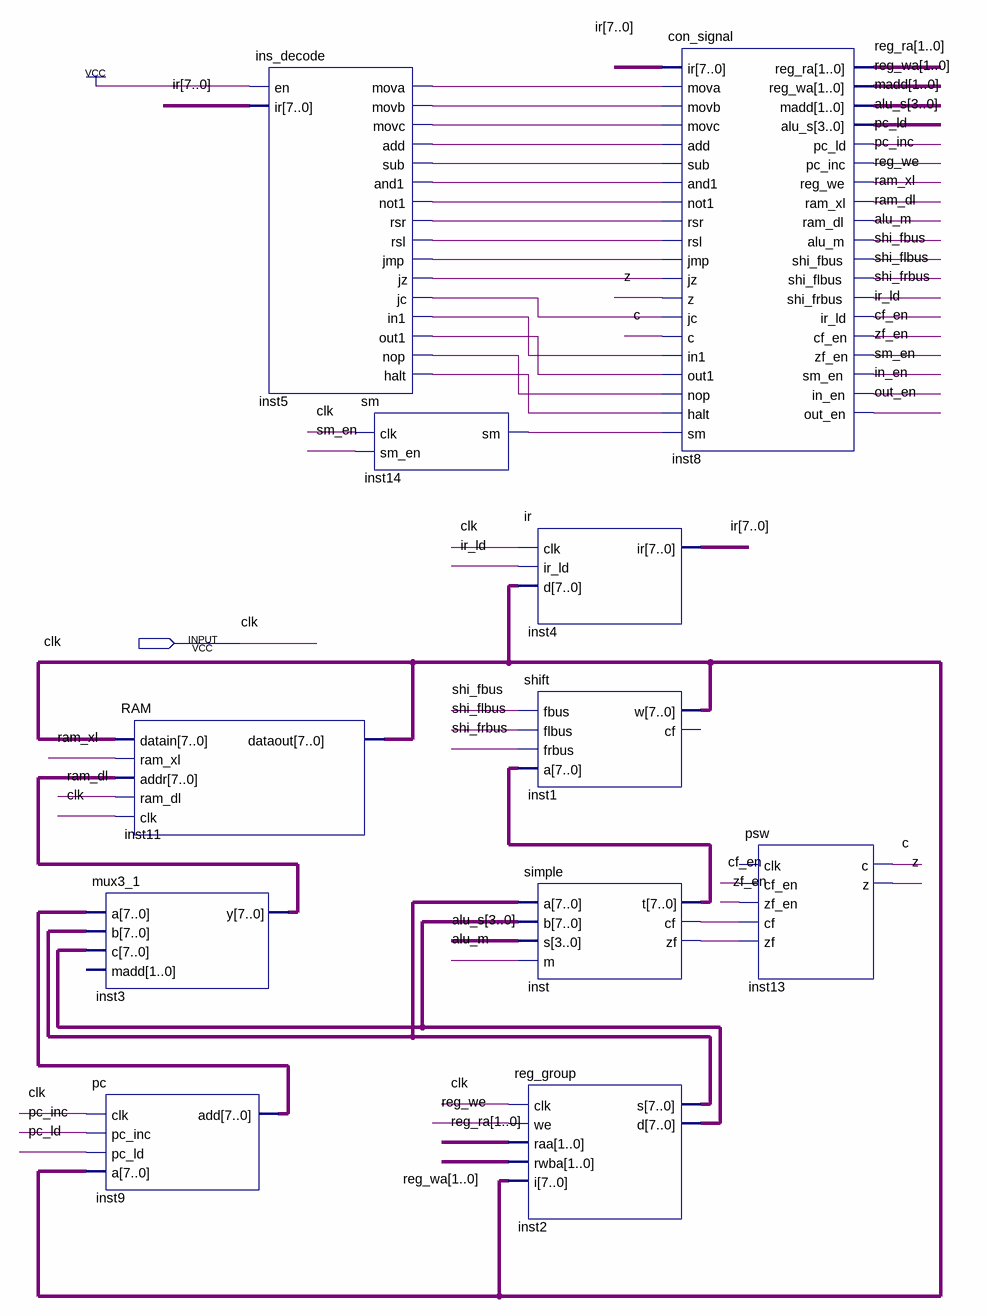
[diagram p0: schematic sheet]
// Quartus schematic MyCPU.bdf as structural Verilog: 11 symbols, 1 pins
module MyCPU (
  input  clk
);

  wire alu_m, c, cf_en, in_en, inst5_add, inst5_and1, inst5_halt, inst5_in1, inst5_jc, inst5_jmp, inst5_jz,
       inst5_mova, inst5_movb, inst5_movc, inst5_nop, inst5_not1, inst5_out1, inst5_rsl, inst5_rsr,
       inst5_sub, inst14_sm, inst_cf, inst_zf, ir_ld, out_en, pc_inc, pc_ld, ram_dl, ram_xl, reg_we,
       shi_fbus, shi_flbus, shi_frbus, sm_en, z, zf_en;
  wire [1:0] madd, reg_ra, reg_wa;
  wire [3:0] alu_s;
  wire [7:0] inst2_d, inst2_s, inst3_y, inst9_add, inst11_dataout, inst_t, ir;

  mux3_1 inst3 (.a(inst9_add), .b(inst2_s), .c(inst2_d), .y(inst3_y));  // open: madd
  pc inst9 (.clk(clk), .pc_inc(pc_inc), .pc_ld(pc_ld), .a(inst11_dataout), .add(inst9_add));
  RAM inst11 (
    .datain(inst11_dataout), .ram_xl(ram_xl), .addr(inst3_y), .ram_dl(ram_dl), .clk(clk),
    .dataout(inst11_dataout));
  ins_decode inst5 (
    .en(1'b1), .ir(ir), .mova(inst5_mova), .movb(inst5_movb), .movc(inst5_movc), .add(inst5_add),
    .sub(inst5_sub), .and1(inst5_and1), .not1(inst5_not1), .rsr(inst5_rsr), .rsl(inst5_rsl), .jmp(inst5_jmp),
    .jz(inst5_jz), .jc(inst5_jc), .in1(inst5_in1), .out1(inst5_out1), .nop(inst5_nop), .halt(inst5_halt));
  sm inst14 (.clk(clk), .sm_en(sm_en), .sm(inst14_sm));
  ir inst4 (.clk(clk), .ir_ld(ir_ld), .d(inst11_dataout), .ir(ir));
  shift inst1 (.fbus(shi_fbus), .flbus(shi_flbus), .frbus(shi_frbus), .a(inst_t), .w(inst11_dataout));  // open: cf
  simple inst (.a(inst2_s), .b(inst2_d), .s(alu_s), .m(alu_m), .t(inst_t), .cf(inst_cf), .zf(inst_zf));
  reg_group inst2 (.clk(clk), .we(reg_we), .raa(reg_ra), .rwba(reg_wa), .i(inst11_dataout), .s(inst2_s), .d(inst2_d));
  con_signal inst8 (
    .ir(ir), .mova(inst5_mova), .movb(inst5_movb), .movc(inst5_movc), .add(inst5_add), .sub(inst5_sub),
    .and1(inst5_and1), .not1(inst5_not1), .rsr(inst5_rsr), .rsl(inst5_rsl), .jmp(inst5_jmp), .jz(inst5_jz),
    .z(z), .jc(inst5_jc), .c(c), .in1(inst5_in1), .out1(inst5_out1), .nop(inst5_nop), .halt(inst5_halt),
    .sm(inst14_sm), .reg_ra(reg_ra), .reg_wa(reg_wa), .madd(madd), .alu_s(alu_s), .pc_ld(pc_ld),
    .pc_inc(pc_inc), .reg_we(reg_we), .ram_xl(ram_xl), .ram_dl(ram_dl), .alu_m(alu_m), .shi_fbus(shi_fbus),
    .shi_flbus(shi_flbus), .shi_frbus(shi_frbus), .ir_ld(ir_ld), .cf_en(cf_en), .zf_en(zf_en), .sm_en(sm_en),
    .in_en(in_en), .out_en(out_en));
  psw inst13 (.cf_en(cf_en), .zf_en(zf_en), .cf(inst_cf), .zf(inst_zf), .c(c), .z(z));  // open: clk
endmodule
